# Altium schematic sheet Top_Level_HIL_RIG.SchDoc
size A4; SheetNumber: 1; SheetTotal: 29
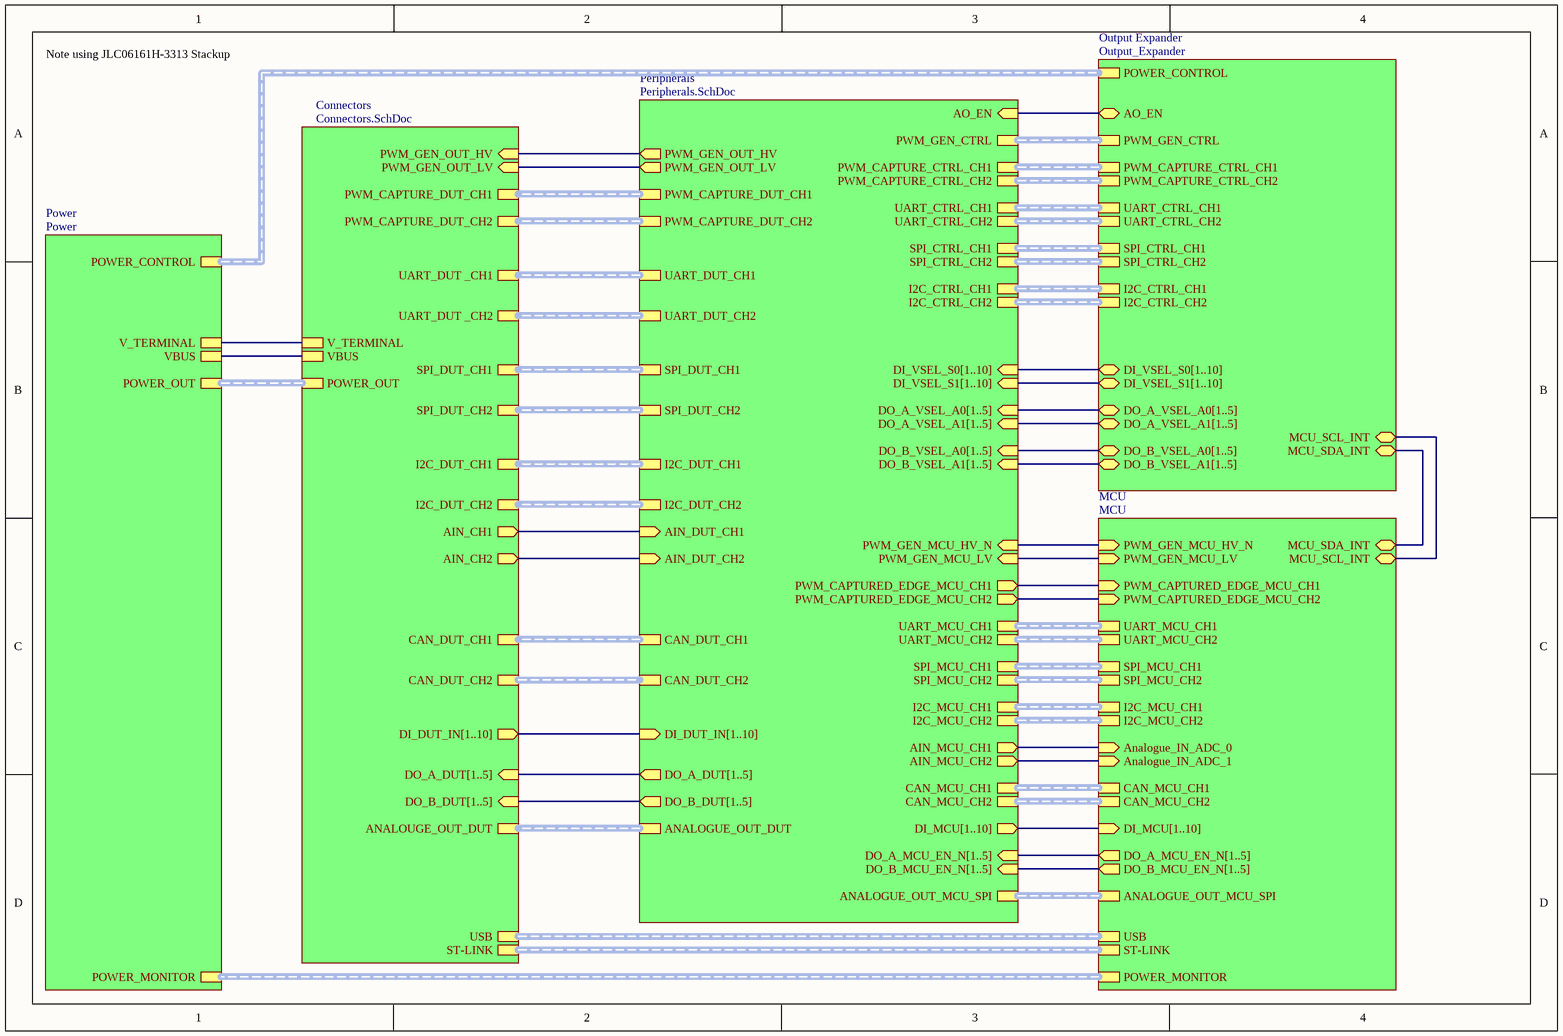
[diagram p0: Top_Level_HIL_RIG.SchDoc]

## Sub-sheets
Connectors = Connectors.SchDoc: V_TERMINAL, VBUS, POWER_OUT (harness Power_Out), PWM_CAPTURE_DUT_CH2 (harness PWM_CAPTURE_DUT_SIGNALS), UART_DUT _CH1 (harness UART_DUT_SIGNALS), CAN_DUT_CH1 (harness CAN_DIFFERENTIAL), CAN_DUT_CH2 (harness CAN_DIFFERENTIAL), DI_DUT_IN[1..10] (out), AIN_CH1 (out), AIN_CH2 (out), SPI_DUT_CH2 (harness SPI_DUT_SIGNALS), SPI_DUT_CH1 (harness SPI_DUT_SIGNALS), I2C_DUT_CH1 (harness I2C_DUT_SIGNALS), I2C_DUT_CH2 (harness I2C_DUT_SIGNALS), UART_DUT _CH2 (harness UART_DUT_SIGNALS), PWM_CAPTURE_DUT_CH1 (harness PWM_CAPTURE_DUT_SIGNALS), PWM_GEN_OUT_LV (in), PWM_GEN_OUT_HV (in), USB (harness USB), ST-LINK (harness ST-LINK), DO_A_DUT[1..5] (in), DO_B_DUT[1..5] (in), ANALOUGE_OUT_DUT (harness ANALOUGE_OUT_DUT_SIGNALS)
MCU = MCU: USB (harness USB), ST-LINK (harness ST-LINK), POWER_MONITOR (harness Power_Monitor), UART_MCU_CH1 (harness UART_MCU_SIGNALS), UART_MCU_CH2 (harness UART_MCU_SIGNALS), DI_MCU[1..10] (in), DO_A_MCU_EN_N[1..5] (out), DO_B_MCU_EN_N[1..5] (out), MCU_SDA_INT (bidir), MCU_SCL_INT (bidir), SPI_MCU_CH1 (harness SPI_MCU_SIGNALS), SPI_MCU_CH2 (harness SPI_MCU_SIGNALS), PWM_GEN_MCU_HV_N (in), PWM_GEN_MCU_LV (in), PWM_CAPTURED_EDGE_MCU_CH1 (in), PWM_CAPTURED_EDGE_MCU_CH2 (in), Analogue_IN_ADC_0 (in), Analogue_IN_ADC_1 (in), CAN_MCU_CH1 (harness CAN_TX_RX), CAN_MCU_CH2 (harness CAN_TX_RX), I2C_MCU_CH1 (harness I2C_MCU_SIGNALS), I2C_MCU_CH2 (harness I2C_MCU_SIGNALS), ANALOGUE_OUT_MCU_SPI (harness ANALOGUE_OUT_MCU_SIGNALS)
Output Expander = Output_Expander: DO_B_VSEL_A1[1..5] (bidir), DO_B_VSEL_A0[1..5] (bidir), DO_A_VSEL_A0[1..5] (bidir), DO_A_VSEL_A1[1..5] (bidir), DI_VSEL_S0[1..10] (bidir), DI_VSEL_S1[1..10] (bidir), PWM_GEN_CTRL (harness PWM_GEN_CTRL_SIGNALS), POWER_CONTROL (harness Power_Ctl), PWM_CAPTURE_CTRL_CH1 (harness PWM_CAPTURE_CTRL_SIGNALS), PWM_CAPTURE_CTRL_CH2 (harness PWM_CAPTURE_CTRL_SIGNALS), MCU_SCL_INT (bidir), MCU_SDA_INT (bidir), SPI_CTRL_CH1 (harness SPI_CTRL_SIGNALS), SPI_CTRL_CH2 (harness SPI_CTRL_SIGNALS), UART_CTRL_CH1 (harness UART_CTRL_SIGNALS), UART_CTRL_CH2 (harness UART_CTRL_SIGNALS), I2C_CTRL_CH1 (harness I2C_CTRL_SIGNALS), I2C_CTRL_CH2 (harness I2C_CTRL_SIGNALS), AO_EN (bidir)
Peripherals = Peripherals.SchDoc: PWM_CAPTURE_DUT_CH2 (harness PWM_CAPTURE_DUT_SIGNALS), UART_DUT_CH1 (harness UART_DUT_SIGNALS), UART_DUT_CH2 (harness UART_DUT_SIGNALS), SPI_DUT_CH2 (harness SPI_DUT_SIGNALS), SPI_DUT_CH1 (harness SPI_DUT_SIGNALS), I2C_DUT_CH2 (harness I2C_DUT_SIGNALS), I2C_DUT_CH1 (harness I2C_DUT_SIGNALS), AIN_DUT_CH1 (in), AIN_DUT_CH2 (in), CAN_DUT_CH1 (harness CAN_DIFFERENTIAL), CAN_DUT_CH2 (harness CAN_DIFFERENTIAL), DI_DUT_IN[1..10] (in), PWM_GEN_CTRL (harness PWM_GEN_CTRL_SIGNALS), PWM_CAPTURE_CTRL_CH1 (harness PWM_CAPTURE_CTRL_SIGNALS), PWM_CAPTURE_CTRL_CH2 (harness PWM_CAPTURE_CTRL_SIGNALS), UART_CTRL_CH1 (harness UART_CTRL_SIGNALS), UART_CTRL_CH2 (harness UART_CTRL_SIGNALS), SPI_CTRL_CH1 (harness SPI_CTRL_SIGNALS), SPI_CTRL_CH2 (harness SPI_CTRL_SIGNALS), I2C_CTRL_CH1 (harness I2C_CTRL_SIGNALS), I2C_CTRL_CH2 (harness I2C_CTRL_SIGNALS), PWM_CAPTURE_DUT_CH1 (harness PWM_CAPTURE_DUT_SIGNALS), PWM_GEN_OUT_LV (out), PWM_GEN_OUT_HV (out), DO_A_DUT[1..5] (out), DO_B_DUT[1..5] (out), CAN_MCU_CH2 (harness CAN_TX_RX), CAN_MCU_CH1 (harness CAN_TX_RX), AIN_MCU_CH2 (out), AIN_MCU_CH1 (out), I2C_MCU_CH2 (harness I2C_MCU_SIGNALS), I2C_MCU_CH1 (harness I2C_MCU_SIGNALS), ANALOGUE_OUT_DUT, AO_EN (in), SPI_MCU_CH2 (harness SPI_MCU_SIGNALS), SPI_MCU_CH1 (harness SPI_MCU_SIGNALS), UART_MCU_CH2 (harness UART_MCU_SIGNALS), UART_MCU_CH1 (harness UART_MCU_SIGNALS), PWM_CAPTURED_EDGE_MCU_CH2 (out), PWM_CAPTURED_EDGE_MCU_CH1 (out), PWM_GEN_MCU_LV (in), PWM_GEN_MCU_HV_N (in), ANALOGUE_OUT_MCU_SPI, DI_VSEL_S0[1..10] (in), DI_VSEL_S1[1..10] (in), DO_A_VSEL_A0[1..5] (in), DO_A_VSEL_A1[1..5] (in), DO_B_VSEL_A0[1..5] (in), DO_B_VSEL_A1[1..5] (in), DI_MCU[1..10] (out), DO_A_MCU_EN_N[1..5] (in), DO_B_MCU_EN_N[1..5] (in)
Power = Power: V_TERMINAL, VBUS, POWER_OUT (harness *), POWER_CONTROL (harness *), POWER_MONITOR (harness *)

## Nets
(unnamed): sheet MCU/MCU_SDA_INT, sheet Output Expander/MCU_SDA_INT
(unnamed): sheet MCU/MCU_SCL_INT, sheet Output Expander/MCU_SCL_INT
(unnamed): sheet MCU/PWM_GEN_MCU_HV_N, sheet Peripherals/PWM_GEN_MCU_HV_N
(unnamed): sheet MCU/PWM_GEN_MCU_LV, sheet Peripherals/PWM_GEN_MCU_LV
(unnamed): sheet MCU/PWM_CAPTURED_EDGE_MCU_CH1, sheet Peripherals/PWM_CAPTURED_EDGE_MCU_CH1
(unnamed): sheet MCU/PWM_CAPTURED_EDGE_MCU_CH2, sheet Peripherals/PWM_CAPTURED_EDGE_MCU_CH2
(unnamed): sheet MCU/Analogue_IN_ADC_0, sheet Peripherals/AIN_MCU_CH1
(unnamed): sheet MCU/Analogue_IN_ADC_1, sheet Peripherals/AIN_MCU_CH2
(unnamed): sheet Power/V_TERMINAL, sheet Connectors/V_TERMINAL
(unnamed): sheet Power/VBUS, sheet Connectors/VBUS
(unnamed): sheet Peripherals/AIN_DUT_CH1, sheet Connectors/AIN_CH1
(unnamed): sheet Peripherals/AIN_DUT_CH2, sheet Connectors/AIN_CH2
(unnamed): sheet Peripherals/PWM_GEN_OUT_LV, sheet Connectors/PWM_GEN_OUT_LV
(unnamed): sheet Peripherals/PWM_GEN_OUT_HV, sheet Connectors/PWM_GEN_OUT_HV
(unnamed): sheet Peripherals/AO_EN, sheet Output Expander/AO_EN

## Buses and harness runs
bus sheet Connectors/DI_DUT_IN[1..10] = sheet Peripherals/DI_DUT_IN[1..10]
bus sheet Connectors/DO_A_DUT[1..5] = sheet Peripherals/DO_A_DUT[1..5]
bus sheet Connectors/DO_B_DUT[1..5] = sheet Peripherals/DO_B_DUT[1..5]
bus sheet MCU/DI_MCU[1..10] = sheet Peripherals/DI_MCU[1..10]
bus sheet MCU/DO_A_MCU_EN_N[1..5] = sheet Peripherals/DO_A_MCU_EN_N[1..5]
bus sheet MCU/DO_B_MCU_EN_N[1..5] = sheet Peripherals/DO_B_MCU_EN_N[1..5]
bus sheet Output Expander/DI_VSEL_S0[1..10] = sheet Peripherals/DI_VSEL_S0[1..10]
bus sheet Output Expander/DI_VSEL_S1[1..10] = sheet Peripherals/DI_VSEL_S1[1..10]
bus sheet Output Expander/DO_A_VSEL_A0[1..5] = sheet Peripherals/DO_A_VSEL_A0[1..5]
bus sheet Output Expander/DO_A_VSEL_A1[1..5] = sheet Peripherals/DO_A_VSEL_A1[1..5]
bus sheet Output Expander/DO_B_VSEL_A0[1..5] = sheet Peripherals/DO_B_VSEL_A0[1..5]
bus sheet Output Expander/DO_B_VSEL_A1[1..5] = sheet Peripherals/DO_B_VSEL_A1[1..5]
harness sheet Connectors/ANALOUGE_OUT_DUT = sheet Peripherals/ANALOGUE_OUT_DUT
harness sheet Connectors/CAN_DUT_CH1 = sheet Peripherals/CAN_DUT_CH1
harness sheet Connectors/CAN_DUT_CH2 = sheet Peripherals/CAN_DUT_CH2
harness sheet Connectors/I2C_DUT_CH1 = sheet Peripherals/I2C_DUT_CH1
harness sheet Connectors/I2C_DUT_CH2 = sheet Peripherals/I2C_DUT_CH2
harness sheet Connectors/POWER_OUT = sheet Power/POWER_OUT
harness sheet Connectors/PWM_CAPTURE_DUT_CH1 = sheet Peripherals/PWM_CAPTURE_DUT_CH1
harness sheet Connectors/PWM_CAPTURE_DUT_CH2 = sheet Peripherals/PWM_CAPTURE_DUT_CH2
harness sheet Connectors/SPI_DUT_CH1 = sheet Peripherals/SPI_DUT_CH1
harness sheet Connectors/SPI_DUT_CH2 = sheet Peripherals/SPI_DUT_CH2
harness sheet Connectors/ST-LINK = sheet MCU/ST-LINK
harness sheet Connectors/UART_DUT _CH1 = sheet Peripherals/UART_DUT_CH1
harness sheet Connectors/UART_DUT _CH2 = sheet Peripherals/UART_DUT_CH2
harness sheet Connectors/USB = sheet MCU/USB
harness sheet MCU/ANALOGUE_OUT_MCU_SPI = sheet Peripherals/ANALOGUE_OUT_MCU_SPI
harness sheet MCU/CAN_MCU_CH1 = sheet Peripherals/CAN_MCU_CH1
harness sheet MCU/CAN_MCU_CH2 = sheet Peripherals/CAN_MCU_CH2
harness sheet MCU/I2C_MCU_CH1 = sheet Peripherals/I2C_MCU_CH1
harness sheet MCU/I2C_MCU_CH2 = sheet Peripherals/I2C_MCU_CH2
harness sheet MCU/POWER_MONITOR = sheet Power/POWER_MONITOR
harness sheet MCU/SPI_MCU_CH1 = sheet Peripherals/SPI_MCU_CH1
harness sheet MCU/SPI_MCU_CH2 = sheet Peripherals/SPI_MCU_CH2
harness sheet MCU/UART_MCU_CH1 = sheet Peripherals/UART_MCU_CH1
harness sheet MCU/UART_MCU_CH2 = sheet Peripherals/UART_MCU_CH2
harness sheet Output Expander/I2C_CTRL_CH1 = sheet Peripherals/I2C_CTRL_CH1
harness sheet Output Expander/I2C_CTRL_CH2 = sheet Peripherals/I2C_CTRL_CH2
harness sheet Output Expander/POWER_CONTROL = sheet Power/POWER_CONTROL
harness sheet Output Expander/PWM_CAPTURE_CTRL_CH1 = sheet Peripherals/PWM_CAPTURE_CTRL_CH1
harness sheet Output Expander/PWM_CAPTURE_CTRL_CH2 = sheet Peripherals/PWM_CAPTURE_CTRL_CH2
harness sheet Output Expander/PWM_GEN_CTRL = sheet Peripherals/PWM_GEN_CTRL
harness sheet Output Expander/SPI_CTRL_CH1 = sheet Peripherals/SPI_CTRL_CH1
harness sheet Output Expander/SPI_CTRL_CH2 = sheet Peripherals/SPI_CTRL_CH2
harness sheet Output Expander/UART_CTRL_CH1 = sheet Peripherals/UART_CTRL_CH1
harness sheet Output Expander/UART_CTRL_CH2 = sheet Peripherals/UART_CTRL_CH2

## Notes on the sheet
- Note using JLC06161H-3313 Stackup